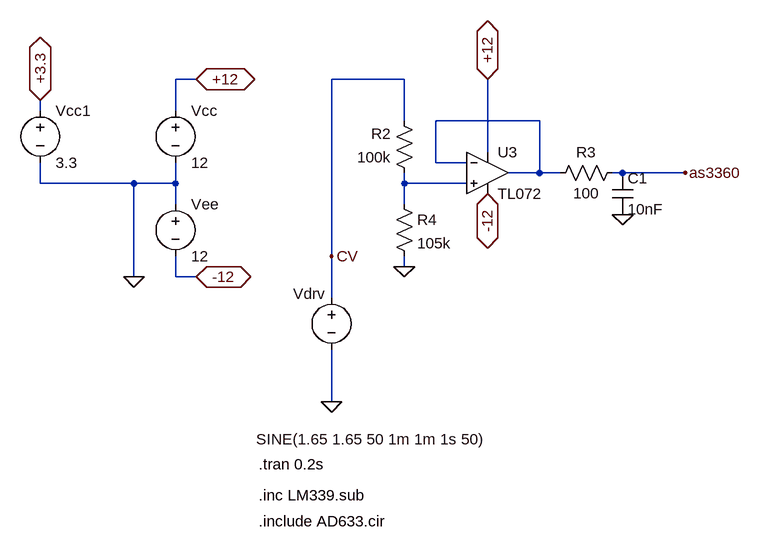
[diagram p0: schematic ldepth_rdepth_dac_to_as3360.asc]
ldepth_rdepth_dac_to_as3360.asc, the LTspice schematic file:
Version 4
SHEET 1 3400 680
WIRE -288 -224 -320 -224
WIRE 32 -224 -80 -224
WIRE -528 -176 -528 -192
WIRE -320 -176 -320 -224
WIRE 32 -160 32 -224
WIRE 240 -160 80 -160
WIRE 160 -112 160 -224
WIRE 80 -96 80 -160
WIRE 128 -96 80 -96
WIRE 240 -80 240 -160
WIRE 240 -80 192 -80
WIRE 272 -80 240 -80
WIRE 368 -80 352 -80
WIRE 464 -80 368 -80
WIRE -528 -64 -528 -96
WIRE -384 -64 -528 -64
WIRE -320 -64 -320 -96
WIRE -320 -64 -384 -64
WIRE 32 -64 32 -80
WIRE 128 -64 32 -64
WIRE -320 -32 -320 -64
WIRE 32 -32 32 -64
WIRE -80 48 -80 -224
WIRE 32 64 32 48
WIRE -384 80 -384 -64
WIRE -320 80 -320 48
WIRE -288 80 -320 80
WIRE -80 112 -80 48
WIRE -80 272 -80 192
FLAG -384 80 0
FLAG -80 272 0
FLAG -288 80 -12
IOPIN -288 80 BiDir
FLAG -288 -224 +12
IOPIN -288 -224 BiDir
FLAG -528 -192 +3.3
IOPIN -528 -192 BiDir
FLAG 160 -48 -12
IOPIN 160 -48 BiDir
FLAG 160 -224 +12
IOPIN 160 -224 BiDir
FLAG -80 48 CV
FLAG 368 -16 0
FLAG 464 -80 as3360
FLAG 32 64 0
SYMBOL voltage -320 -192 R0
WINDOW 123 0 0 Left 0
WINDOW 39 0 0 Left 0
SYMATTR InstName Vcc
SYMATTR Value 12
SYMBOL voltage -80 96 R0
WINDOW 123 0 0 Left 0
WINDOW 39 0 0 Left 0
WINDOW 0 -59 10 Left 2
WINDOW 3 -116 234 Left 2
SYMATTR InstName Vdrv
SYMATTR Value SINE(1.65 1.65 50 1m 1m 1s 50)
SYMBOL voltage -320 -48 R0
WINDOW 123 0 0 Left 0
WINDOW 39 0 0 Left 0
SYMATTR InstName Vee
SYMATTR Value 12
SYMBOL voltage -528 -192 R0
WINDOW 123 0 0 Left 0
WINDOW 39 0 0 Left 0
SYMATTR InstName Vcc1
SYMATTR Value 3.3
SYMBOL OpAmps\\TL072 160 -144 R0
SYMATTR InstName U3
SYMBOL cap 352 -80 R0
SYMATTR InstName C1
SYMATTR Value 10nF
SYMBOL res 368 -96 R90
WINDOW 0 0 56 VBottom 2
WINDOW 3 32 56 VTop 2
SYMATTR InstName R3
SYMATTR Value 100
SYMBOL res 48 -64 R180
WINDOW 0 36 76 Left 2
WINDOW 3 36 40 Left 2
SYMATTR InstName R2
SYMATTR Value 100k
SYMBOL res 16 -48 R0
SYMATTR InstName R4
SYMATTR Value 105k
TEXT -192 368 Left 2 !.tran 0.2s
TEXT -192 416 Left 2 !.inc LM339.sub
TEXT -192 456 Left 2 !.include AD633.cir

The netlist it stands for:
* ldepth_rdepth_dac_to_as3360.asc
Vcc +12 0 12
Vdrv CV 0 SINE(1.65 1.65 50 1m 1m 1s 50)
Vee 0 -12 12
Vcc1 +3.3 0 3.3
XU3 N002 N001 +12 -12 N001 TL072  ; pins In+ In- V+ V- OUT
C1 as3360 0 10nF
R3 as3360 N001 100
R2 N002 CV 100k
R4 N002 0 105k
.tran 0.2s
.inc LM339.sub
.include AD633.cir
.backanno
.end